# EAGLE design On Board Computer (EAGLE 9.6.2)

## Sheet 1 of 3
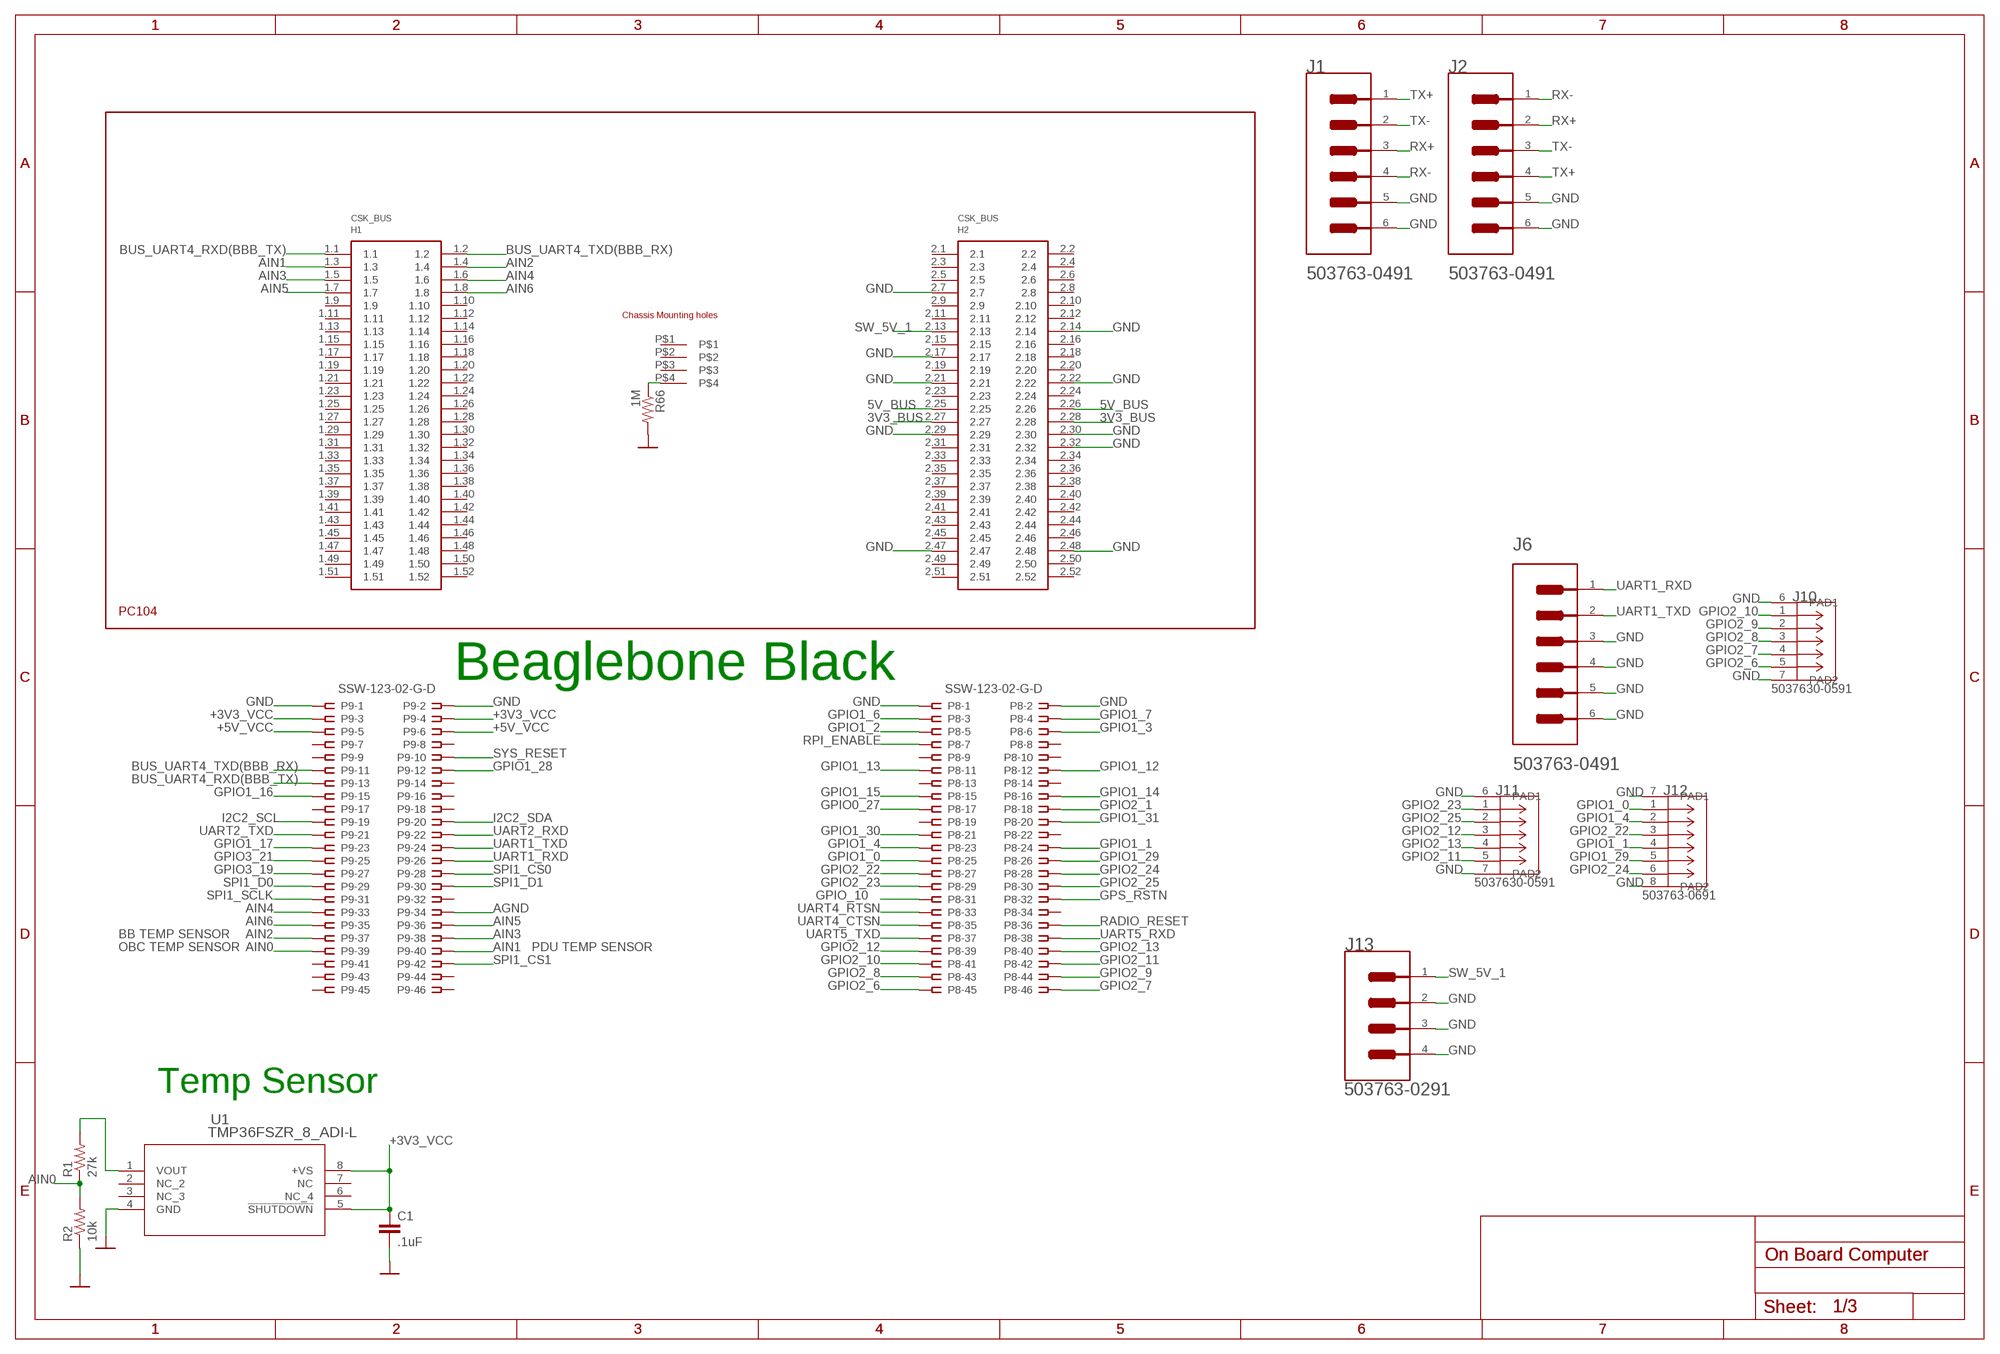
[diagram p0: schematic, sheet 1]

### Parts
C1  .1uF  CAP0805  [0805]
H1  PC104_WCONN  [PC104_WCONN]
J1  MOLEX_503763-0491MOLEX_503763-0491_0_0  [MOLEX_503763-0491_0]
J2  MOLEX_503763-0491MOLEX_503763-0491_0_0  [MOLEX_503763-0491_0]
J6  MOLEX_503763-0491MOLEX_503763-0491_0_0  [MOLEX_503763-0491_0]
J10  503763-0591  [CONN_5037630591_MOL]
J11  503763-0591  [CONN_5037630591_MOL]
J12  503763-0691  [CONN_503763-0691_MOL]
J13  MOLEX_503763-0291MOLEX_503763-0291_0_0  [MOLEX_503763-0291_0]
P8  SSW-123-02-G-D  [SSW-123-02-G-D]
P9  SSW-123-02-G-D  [SSW-123-02-G-D]
R1  27k  RESISTOR0805-RES  [0805]
R2  10k  RESISTOR0805-RES  [0805]
R66  1M  RESISTOR0805-RES  [0805]
U1  TMP36FSZR_8_ADI-L  [R_8_ADI-L]

### Nets
3V3_BUS: H1.2.27 H1.2.28 ; also sheet 3
5V_BUS: H1.2.25 H1.2.26
+3V3_VCC: C1.1 P9.3 P9.4 U1.5(!SHUTDOWN) U1.8(+VS) ; also sheet 3
+5V_VCC: P9.5 P9.6 ; also sheet 2
AGND: P9.34
AIN0: P9.39 R1.1 R2.2
AIN1: H1.1.3 P9.40
AIN2: H1.1.4 P9.37
AIN3: H1.1.5 P9.38
AIN4: H1.1.6 P9.33
AIN5: H1.1.7 P9.36
AIN6: H1.1.8 P9.35
BUS_UART4_RXD(BBB_TX): H1.1.1 P9.13
BUS_UART4_TXD(BBB_RX): H1.1.2 P9.11
GND: C1.2 H1.2.7 H1.2.14 H1.2.17 H1.2.21 H1.2.22 H1.2.29 H1.2.30 H1.2.32 H1.2.47 H1.2.48 J1.5(MNT_1) J1.6(MNT_2) J2.5(MNT_1) J2.6(MNT_2) J6.3 J6.4 J6.5(MNT_1) J6.6(MNT_2) J10.6(PAD1) J10.7(PAD2) J11.6(PAD1) J11.7(PAD2) J12.7(PAD1) J12.8(PAD2) J13.2 J13.3(MNT_1) J13.4(MNT_2) P8.1 P8.2 P9.1 P9.2 R2.1 R66.2 U1.4(GND) ; also sheet 2,3
GPIO0_27: P8.17
GPIO1_0: J12.1 P8.25
GPIO1_1: J12.4 P8.24
GPIO1_2: P8.5
GPIO1_3: P8.6
GPIO1_4: J12.2 P8.23
GPIO1_6: P8.3
GPIO1_7: P8.4
GPIO1_12: P8.12
GPIO1_13: P8.11
GPIO1_14: P8.16
GPIO1_15: P8.15
GPIO1_16: P9.15
GPIO1_17: P9.23
GPIO1_28: P9.12
GPIO1_29: J12.5 P8.26
GPIO1_30: P8.21
GPIO1_31: P8.20
GPIO2_1: P8.18
GPIO2_6: J10.5 P8.45
GPIO2_7: J10.4 P8.46
GPIO2_8: J10.3 P8.43
GPIO2_9: J10.2 P8.44
GPIO2_10: J10.1 P8.41
GPIO2_11: J11.5 P8.42
GPIO2_12: J11.3 P8.39
GPIO2_13: J11.4 P8.40
GPIO2_22: J12.3 P8.27
GPIO2_23: J11.1 P8.29
GPIO2_24: J12.6 P8.28
GPIO2_25: J11.2 P8.30
GPIO3_19: P9.27
GPIO3_21: P9.25
GPIO_10: P8.31
GPS_RSTN: P8.32 ; also sheet 3
I2C2_SCL: P9.19 ; also sheet 3
I2C2_SDA: P9.20 ; also sheet 3
N$15: R1.2 U1.1(VOUT)
N$94: H1.P$4 R66.1
RADIO_RESET: P8.36 ; also sheet 3
RPI_ENABLE: P8.7 ; also sheet 2
RX+: J1.3 J2.2
RX-: J1.4 J2.1
SPI1_CS0: P9.28
SPI1_CS1: P9.42 ; also sheet 3
SPI1_D0: P9.29 ; also sheet 3
SPI1_D1: P9.30 ; also sheet 3
SPI1_SCLK: P9.31 ; also sheet 3
SW_5V_1: H1.2.13 J13.1
SYS_RESET: P9.10
TX+: J1.1 J2.4
TX-: J1.2 J2.3
UART1_RXD: J6.1 P9.26
UART1_TXD: J6.2 P9.24
UART2_RXD: P9.22 ; also sheet 2
UART2_TXD: P9.21 ; also sheet 2
UART4_CTSN: P8.35
UART4_RTSN: P8.33
UART5_RXD: P8.38 ; also sheet 3
UART5_TXD: P8.37 ; also sheet 3
Unconnected: H1.1.9 H1.1.10 H1.1.11 H1.1.12 H1.1.13 H1.1.14 H1.1.15 H1.1.16 H1.1.17 H1.1.18 H1.1.19 H1.1.20 H1.1.21 H1.1.22 H1.1.23 H1.1.24 H1.1.25 H1.1.26 H1.1.27 H1.1.28 H1.1.29 H1.1.30 H1.1.31 H1.1.32 H1.1.33 H1.1.34 H1.1.35 H1.1.36 H1.1.37 H1.1.38 H1.1.39 H1.1.40 H1.1.41 H1.1.42 H1.1.43 H1.1.44 H1.1.45 H1.1.46 H1.1.47 H1.1.48 H1.1.49 H1.1.50 H1.1.51 H1.1.52 H1.2.1 H1.2.2 H1.2.3 H1.2.4 H1.2.5 H1.2.6 H1.2.8 H1.2.9 H1.2.10 H1.2.11 H1.2.12 H1.2.15 H1.2.16 H1.2.18 H1.2.19 H1.2.20 H1.2.23 H1.2.24 H1.2.31 H1.2.33 H1.2.34 H1.2.35 H1.2.36 H1.2.37 H1.2.38 H1.2.39 H1.2.40 H1.2.41 H1.2.42 H1.2.43 H1.2.44 H1.2.45 H1.2.46 H1.2.49 H1.2.50 H1.2.51 H1.2.52 H1.P$1 H1.P$2 H1.P$3 P8.8 P8.9 P8.10 P8.13 P8.14 P8.19 P8.22 P8.34 P9.7 P9.8 P9.9 P9.14 P9.16 P9.17 P9.18 P9.32 P9.41 P9.43 P9.44 P9.45 P9.46 U1.2(NC_2) U1.3(NC_3) U1.6(NC_4) U1.7(NC)

### Notes on the sheet
- Beaglebone Black
- BB TEMP SENSOR
- OBC TEMP SENSOR | PDU TEMP SENSOR
- Temp Sensor

## Sheet 2 of 3
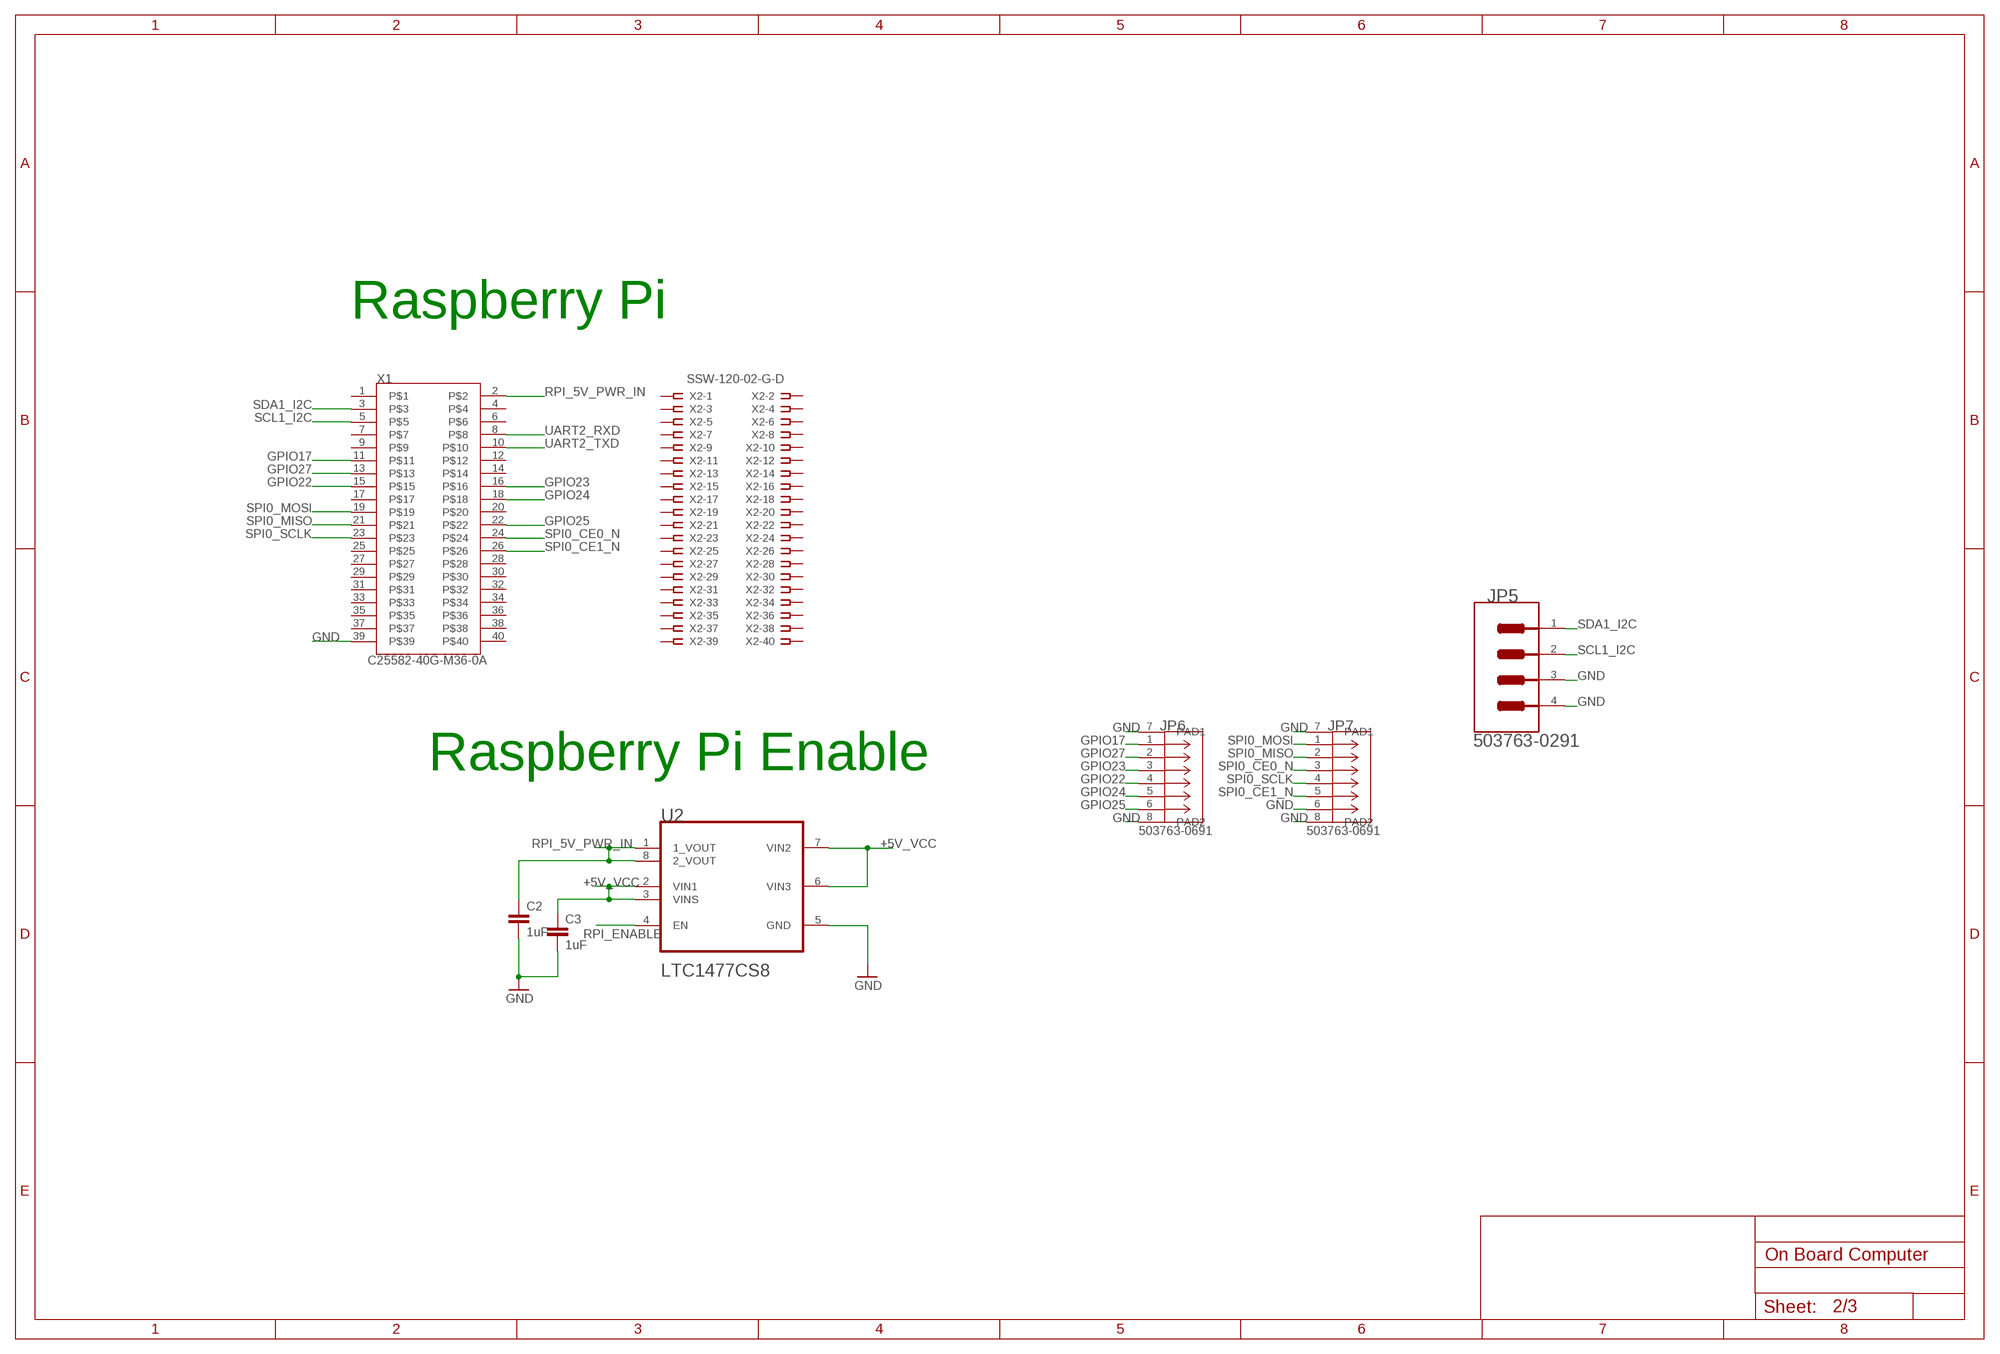
[diagram p1: schematic, sheet 2]

### Parts
C2  1uF  CAP0805  [0805]
C3  1uF  CAP0805  [0805]
JP5  MOLEX_503763-0291MOLEX_503763-0291_0_0  [MOLEX_503763-0291_0]
JP6  503763-0691  [CONN_503763-0691_MOL]
JP7  503763-0691  [CONN_503763-0691_MOL]
U2  LTC1477CS8LINEAR_TECHNOLOGY_LTC1477CS8_0_2  [LINEAR_TECHNOLOGY_LTC1477CS8_2]
X1  C25582-40G-M36-0A  [ADAFRUIT_C25582-40G-M36-0A_0]
X2  SSW-120-02-G-D  [SSW-120-02-G-D]

### Nets
+5V_VCC: C3.1 U2.2(VIN1) U2.3(VINS) U2.6(VIN3) U2.7(VIN2) ; also sheet 1
GND: C2.2 C3.2 JP5.3(MNT_1) JP5.4(MNT_2) JP6.7(PAD1) JP6.8(PAD2) JP7.6 JP7.7(PAD1) JP7.8(PAD2) U2.5(GND) X1.39 ; also sheet 1,3
GPIO17: JP6.1 X1.11
GPIO22: JP6.4 X1.15
GPIO23: JP6.3 X1.16
GPIO24: JP6.5 X1.18
GPIO25: JP6.6 X1.22
GPIO27: JP6.2 X1.13
RPI_5V_PWR_IN: C2.1 U2.1(1_VOUT) U2.8(2_VOUT) X1.2
RPI_ENABLE: U2.4(EN) ; also sheet 1
SCL1_I2C: JP5.2 X1.5
SDA1_I2C: JP5.1 X1.3
SPI0_CE0_N: JP7.3 X1.24
SPI0_CE1_N: JP7.5 X1.26
SPI0_MISO: JP7.2 X1.21
SPI0_MOSI: JP7.1 X1.19
SPI0_SCLK: JP7.4 X1.23
UART2_RXD: X1.8 ; also sheet 1
UART2_TXD: X1.10 ; also sheet 1
Unconnected: X1.1 X1.4 X1.6 X1.7 X1.9 X1.12 X1.14 X1.17 X1.20 X1.25 X1.27 X1.28 X1.29 X1.30 X1.31 X1.32 X1.33 X1.34 X1.35 X1.36 X1.37 X1.38 X1.40 X2.1 X2.2 X2.3 X2.4 X2.5 X2.6 X2.7 X2.8 X2.9 X2.10 X2.11 X2.12 X2.13 X2.14 X2.15 X2.16 X2.17 X2.18 X2.19 X2.20 X2.21 X2.22 X2.23 X2.24 X2.25 X2.26 X2.27 X2.28 X2.29 X2.30 X2.31 X2.32 X2.33 X2.34 X2.35 X2.36 X2.37 X2.38 X2.39 X2.40

### Notes on the sheet
- Raspberry Pi
- Raspberry Pi Enable

## Sheet 3 of 3
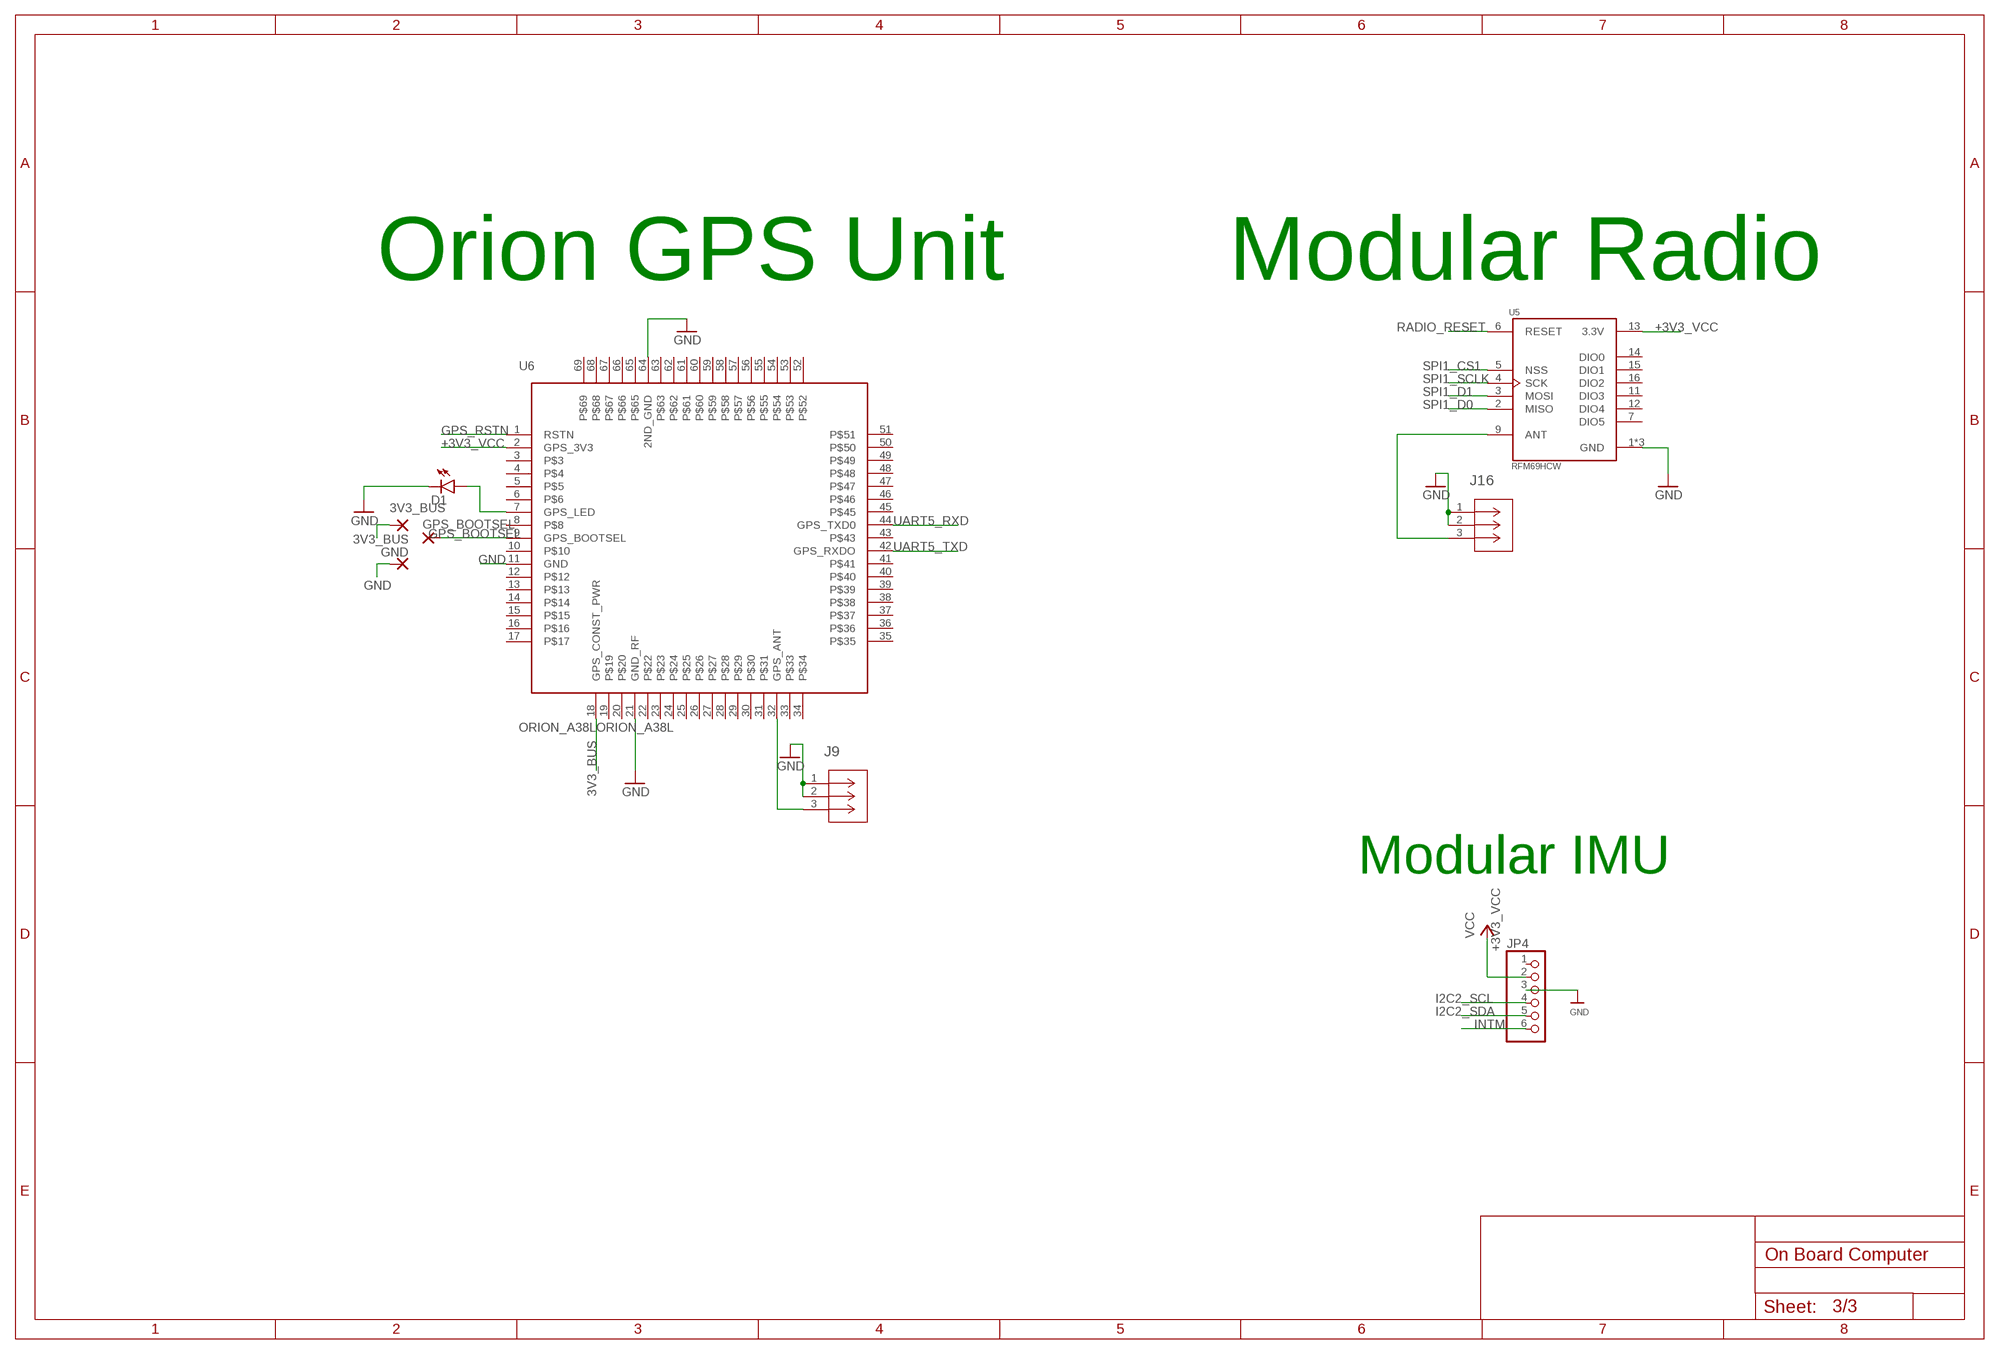
[diagram p2: schematic, sheet 3]

### Parts
3V3_BUS  1,6/0,9  [1,6/0,9]
D1  LEDCHIP-LED0603  [CHIP-LED0603]
GND  GND  1,6/0,9  [1,6/0,9]
GPS_BOOTSEL  1,6/0,9  [1,6/0,9]
J9  U.FL-R-SMT-1(01)  [CONN_-SMT-1(01)]
J16  U.FL-R-SMT-1(01)  [CONN_-SMT-1(01)]
JP4  HEADER-1X670MIL  [1X06_ROUND_70]
U5  RFM69HCW  [RFM69HCW]
U6  ORION_A38LORION_A38L  [ORION_A38L]

### Nets
3V3_BUS: 3V3_BUS.1(P) U6.18(GPS_CONST_PWR) ; also sheet 1
+3V3_VCC: JP4.2 U5.13(3.3V) U6.2(GPS_3V3) ; supply symbol labelled VCC ; also sheet 1
GND: D1.C GND.1(P) J9.1 J9.2 J16.1 J16.2 JP4.3 U5.1(GND) U5.8(GND) U5.10(GND) U6.11(GND) U6.21(GND_RF) U6.64(2ND_GND) ; also sheet 1,2
GPS_BOOTSEL: GPS_BOOTSEL.1(P) U6.9(GPS_BOOTSEL)
GPS_RSTN: U6.1(RSTN) ; also sheet 1
I2C2_SCL: JP4.4 ; also sheet 1
I2C2_SDA: JP4.5 ; also sheet 1
INTM: JP4.6
N$17: J9.3 U6.32(GPS_ANT)
N$19: J16.3 U5.9(ANT)
N$21: D1.A U6.7(GPS_LED)
RADIO_RESET: U5.6(RESET) ; also sheet 1
SPI1_CS1: U5.5(NSS) ; also sheet 1
SPI1_D0: U5.2(MISO) ; also sheet 1
SPI1_D1: U5.3(MOSI) ; also sheet 1
SPI1_SCLK: U5.4(SCK) ; also sheet 1
UART5_RXD: U6.44(GPS_TXD0) ; also sheet 1
UART5_TXD: U6.42(GPS_RXDO) ; also sheet 1
Unconnected: JP4.1 U5.7(DIO5) U5.11(DIO3) U5.12(DIO4) U5.14(DIO0) U5.15(DIO1) U5.16(DIO2) U6.3 U6.4 U6.5 U6.6 U6.8 U6.10 U6.12 U6.13 U6.14 U6.15 U6.16 U6.17 U6.19 U6.20 U6.22 U6.23 U6.24 U6.25 U6.26 U6.27 U6.28 U6.29 U6.30 U6.31 U6.33 U6.34 U6.35 U6.36 U6.37 U6.38 U6.39 U6.40 U6.41 U6.43 U6.45 U6.46 U6.47 U6.48 U6.49 U6.50 U6.51 U6.52 U6.53 U6.54 U6.55 U6.56 U6.57 U6.58 U6.59 U6.60 U6.61 U6.62 U6.63 U6.65 U6.66 U6.67 U6.68 U6.69

### Notes on the sheet
- Orion GPS Unit | Modular Radio
- Modular IMU

## Library data of the parts
3V3_BUS GND GPS_BOOTSEL = wirepad:1,6/0,9: THROUGH-HOLE PAD
C1-C3 = HSFL_Main_Library:CAP: Capacitor Standard 0603 ceramic capacitor, and 0.1" leaded capacitor.
D1 = led:LED: LED OSRAM: - CHIPLED LG R971, LG N971, LY N971, LG Q971, LY Q971, LO R971, LY R971 LH N974, LH R974 LS Q976, LO Q976, LY Q976 LO Q996 - Hyper CHIPLED LW Q18S LB Q993, LB Q99A, LB R99A - SideLED LS A670, LO A670, LY A670, LG A670, LP A670 LB A673, LV A673, LT A673, LW A673 LH A674 LY A675 LS A676, LA A676, LO A676, LY A676, LW A676 LS A679, LY A679, LG A679 - Hyper Micro SIDELED® LS Y876, LA Y876, LO Y876, LY Y876 LT Y87S - SmartLED LW L88C, LW L88S LB L89C, LB L89S, LG L890 LS L89K, LO L89K, LY L89K LS L896, LA L896, LO L896, LY L896 - TOPLED LS T670, LO T670, LY T670, LG T670, LP T670 LSG T670, LSP T670, LSY T670, LOP T670, LYG T670 LG T671, LOG T671, LSG T671 LB T673, LV T673, LT T673, LW T673 LH T674 LS T676, LA T676, LO T676, LY T676, LB T676, LH T676, LSB T676, LW T676 LB T67C, LV T67C, LT T67C, LS T67K, LO T67K, LY T67K, LW E67C LS E67B, LA E67B, LO E67B, LY E67B, LB E67C, LV E67C, LT E67C LW T67C LS T679, LY T679, LG T679 LS T770, LO T770, LY T770, LG T770, LP T770 LB T773, LV T773, LT T773, LW T773 LH T774 LS E675, LA E675, LY E675, LS T675 LS T776, LA T776, LO T776, LY T776, LB T776 LHGB T686 LT T68C, LB T68C - Hyper Mini TOPLED® LB M676 - Mini TOPLED Santana® LG M470 LS M47K, LO M47K, LY M47K Source: http://www.osram.convergy.de LUXEON: - LUMILED® LXK2-PW12-R00, LXK2-PW12-S00, LXK2-PW14-U00, LXK2-PW14-V00 LXK2-PM12-R00, LXK2-PM12-S00, LXK2-PM14-U00 LXK2-PE12-Q00, LXK2-PE12-R00, LXK2-PE12-S00, LXK2-PE14-T00, LXK2-PE14-U00 LXK2-PB12-K00, LXK2-PB12-L00, LXK2-PB12-M00, LXK2-PB14-N00, LXK2-PB14-P00, LXK2-PB14-Q00 LXK2-PR12-L00, LXK2-PR12-M00, LXK2-PR14-Q00, LXK2-PR14-R00 LXK2-PD12-Q00, LXK2-PD12-R00, LXK2-PD12-S00 LXK2-PH12-R00, LXK2-PH12-S00 LXK2-PL12-P00, LXK2-PL12-Q00, LXK2-PL12-R00 Source: www.luxeon.com KINGBRIGHT: KA-3528ASYC Source: www.kingbright.com
H1 = HSFL_Main_Library:PC104_WCONN
J1 J2 J6 = Molex - 503763-0491:MOLEX_503763-0491: Wire-To-Board Connector, Pico-Lock 503763 Series, Surface Mount, Header, 4 Contacts, 1 mm; AUTOMOTIVE: No; CENTROID_NOT_SPECIFIED: No; CONN_GENDER: Male; CONN_ORIENTATION: Right Angle; CONTACT_MATERIAL: Gold,Nickel; CURRENT_RATING: 1.5A; DATASHEET: https://www.molex.com/webdocs/datasheets/pdf/en-us/5037630491_PCB_HEADERS.pdf; DEVICE_CLASS_L1: Connectors; DEVICE_CLASS_L2: Headers and Wire Housings; DEVICE_CLASS_L3: unset; DIGIKEY_DESCRIPTION: CONN HEADER 1MM R/A 4CKT; DIGIKEY_PART_NUMBER: WM10655CT-ND; FOOTPRINT_URL: https://www.molex.com/pdm_docs/sd/5037630491_sd.pdf; FOOTPRINT_VARIANT_NAME_0: Recommended_Land_Pattern; HEIGHT: 1.7mm; LEAD_FREE: Yes; MF: Molex; MFG_PACKAGE_IDENT: 503763-0491; MFG_PACKAGE_IDENT_DATE: 0; MFG_PACKAGE_IDENT_REV: 0; MOUSER_PART_NUMBER: 538-503763-0491; MPN: 503763-0491; NUMBER_OF_CONTACTS: 4; NUMBER_OF_ROWS: 1; PACKAGE: HDR4; PITCH: 1mm; PREFIX: J; ROHS: Yes; TEMPERATURE_RANGE_HIGH: +105°C; TEMPERATURE_RANGE_LOW: -40°C; VERIFICATION_VERSION: 0.0.0.1; VOLTAGE_RATING: 150V
J9 J16 = U.FL-R-SMT:U.FL-R-SMT-1(01); BUILT_BY: EMA_Matt; COPYRIGHT: Copyright (C) 2018 Accelerated Designs. All rights reserved; MANUFACTURER_PART_NUMBER: U.FL-R-SMT-1(01); SOURCELIBRARY: Hirose_12_20_2019; VENDOR: Hirose
J10 J11 = Improved Molex 503763-0591:503763-0591; BUILT_BY: EMA_Cory; COPYRIGHT: Copyright (C) 2018 Accelerated Designs. All rights reserved; DATASHEET: https://www.molex.com/pdm_docs/sd/5037630591_sd.pdf; MANUFACTURER_PART_NUMBER: 503763-0591; SOURCELIBRARY: Add_to_database_2020-12-14; VENDOR: Molex Connector Corporation
J12 JP6 JP7 = Improved Molex 503763-0691:503763-0691; BUILT_BY: EMA_Cory; COPYRIGHT: Copyright (C) 2018 Accelerated Designs. All rights reserved; DATASHEET: https://www.digikey.com/products/en?keywords=503763-0691; MANUFACTURER_PART_NUMBER: 503763-0691; SOURCELIBRARY: Molex_2020-01-22; VENDOR: Molex Connector Corporation
J13 JP5 = Molex - 503763-0291:MOLEX_503763-0291: 2 Positions Header Connector 0.039" (1.00mm) Surface Mount, Right Angle Gold; CENTROID_NOT_SPECIFIED: No; DATASHEET: http://www.molex.com/pdm_docs/sd/5037630291_sd.pdf; DIGIKEY_DESCRIPTION: CONN HEADER 1MM R/A 2CKT; DIGIKEY_PART_NUMBER: WM10654CT-ND; LEAD_FREE: yes; MF: Molex; MOUSER_PART_NUMBER: 538-503763-0291; MPN: 503763-0291; PACKAGE: HDR02; PREFIX: J; ROHS: yes; TEMPERATURE_RANGE_HIGH: +105°C; TEMPERATURE_RANGE_LOW: -40°C
JP4 = microbuilder:HEADER-1X6: PIN HEADER
P8 P9 = con-samtec:SSW-123-02-G: THROUGH-HOLE .025" SQ POST SOCKET Source: Samtec SSW.pdf; MF: Samtec Inc.; MPN: SSW-123-02-G-D; OC_FARNELL: unknown; OC_NEWARK: 11P9690
R1 R2 R66 = HSFL_Main_Library:RESISTOR: Resistor Basic schematic elements and footprints for 0603, 1206, and PTH resistors.
U1 = TMP36FSZR_8:TMP36FSZ; COPYRIGHT: Copyright (C) 2021 Ultra Librarian. All rights reserved.; MANUFACTURER_PART_NUMBER: TMP36FSZ; MFR_NAME: Analog Devices Inc
U2 = Artemis:LTC1477CS8: LT-LTC1477-S8-8; CIIVA_IDS: 1432281; COMPONENT_LINK_1_DESCRIPTION: Manufacturer URL; COMPONENT_LINK_1_URL: http://www.linear.com/; COMPONENT_LINK_3_DESCRIPTION: Package Specification; COMPONENT_LINK_3_URL: http://cds.linear.com/docs/en/packaging/05081610_G_SO8.pdf; DATASHEET: http://cds.linear.com/docs/en/datasheet/lt1477.pdf; FOOTPRINT_VARIANT_NAME_0: Level C; FOOTPRINT_VARIANT_NAME_1: Level B; FOOTPRINT_VARIANT_NAME_2: Level A; IMPORTED: yes; IMPORTED_FROM: vault; IMPORT_TS: 1521843574; MF: Linear Technology; MOUNTING_TECHNOLOGY: Surface Mount; MPN: LTC1477CS8; PACKAGE: S8-8; PACKAGE_DESCRIPTION: 8-Pin Plastic Small Outline (Narrow .150 Inch), Body 4.9 x 3.9 mm, Pitch 1.27 mm; PACKAGE_VERSION: Rev. G, 03/2012; PREFIX: U; RELEASE_DATE: 1377817843; ROHS: No; VAULT_GUID: 635B2D7C-EC07-409E-A57F-666E02CD64AC; VAULT_REVISION: 6B8B57C2-2CB3-4970-A31A-1EB58B636423
U5 = Artemis:RFM69HCW: Rfm69hcw Wireless Transceiver 91 Check prices <https://pricing.snapeda.com/parts/RFM69HCW-315S2/HOPERF/view-part?ref=eda>; AVAILABILITY: No availability data; DESCRIPTION: General ISM < 1GHz Transceiver Module 915MHz Surface Mount; MF: HOPERF; MP: RFM69HCW-315S2; PACKAGE: Module SparkFun Electronics; PRICE: None
U6 = Artemis:ORION_A38L
X1 = Adafruit - C25582-40G-M36-0A:C25582-40G-M36-0A
X2 = con-samtec:SSW-120-02-G: THROUGH-HOLE .025" SQ POST SOCKET Source: Samtec SSW.pdf; MF: Samtec Inc.; MPN: SSW-120-02-G-D; OC_FARNELL: unknown; OC_NEWARK: 11P9639

## Net classes
2 lowpower: width 0.305 mm, drill 0.483 mm

## Board
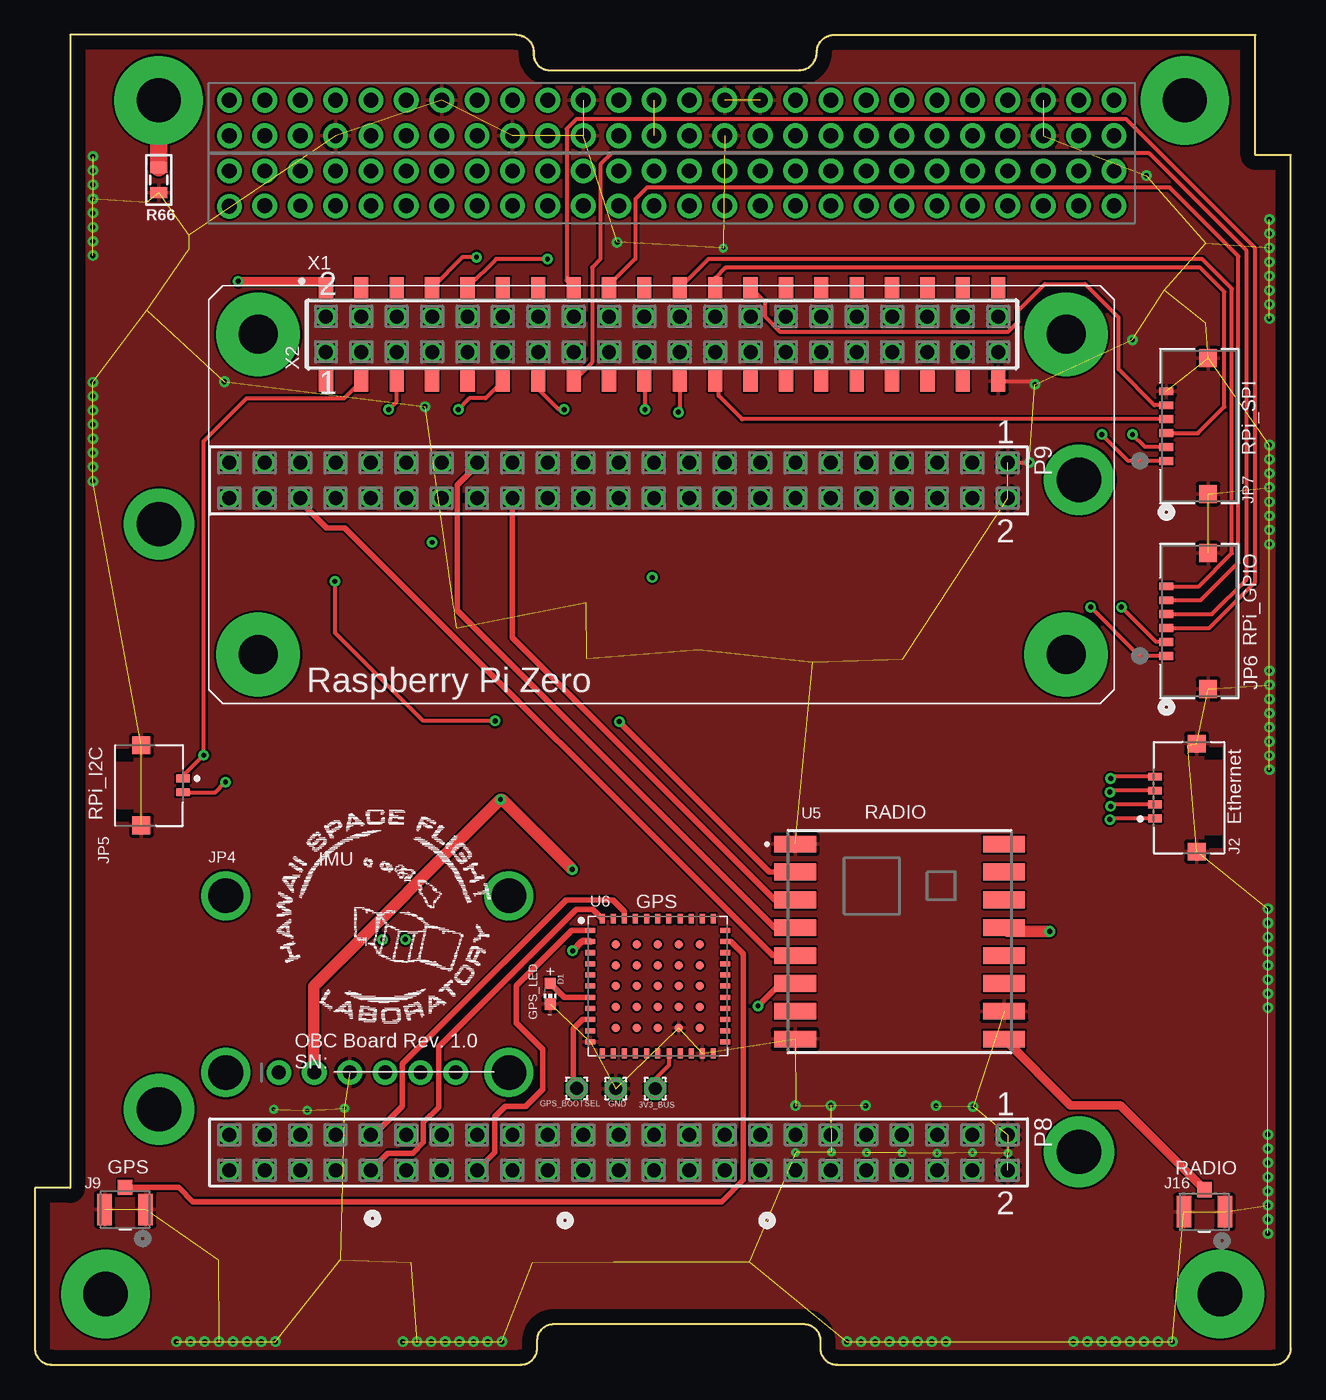
[diagram p3: board, top side]
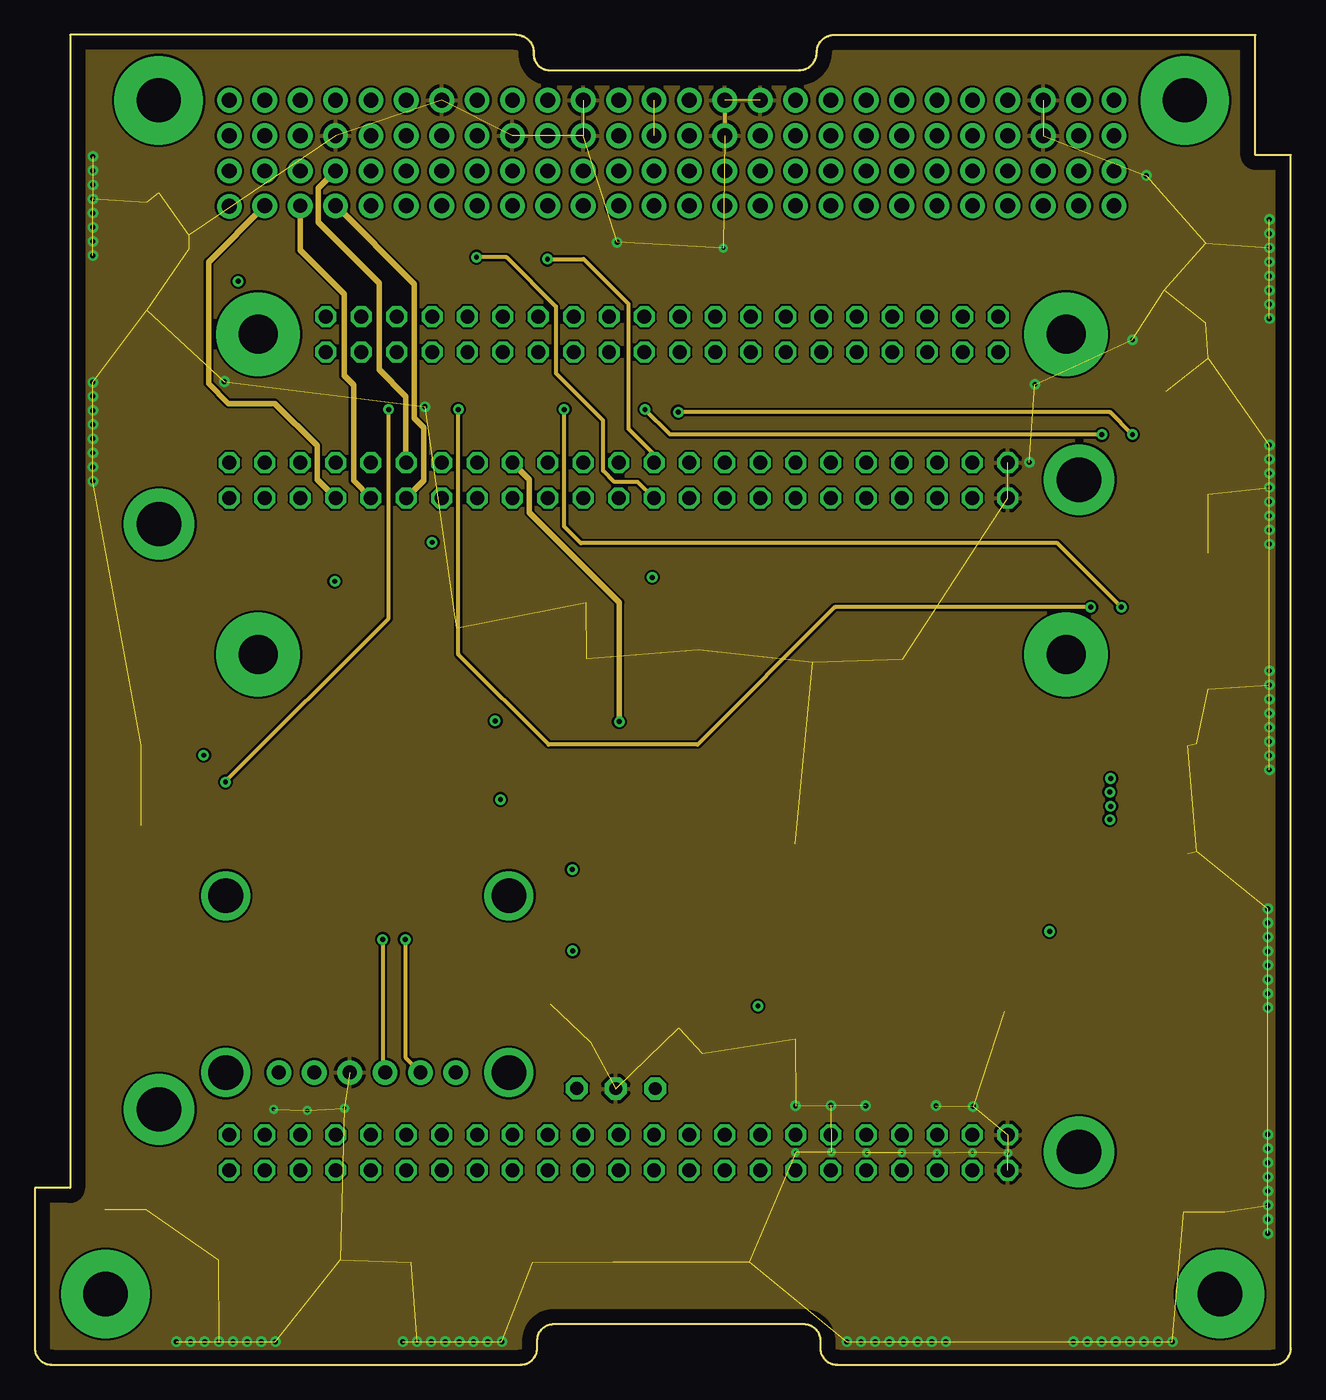
[diagram p4: board, inner layer Route2]
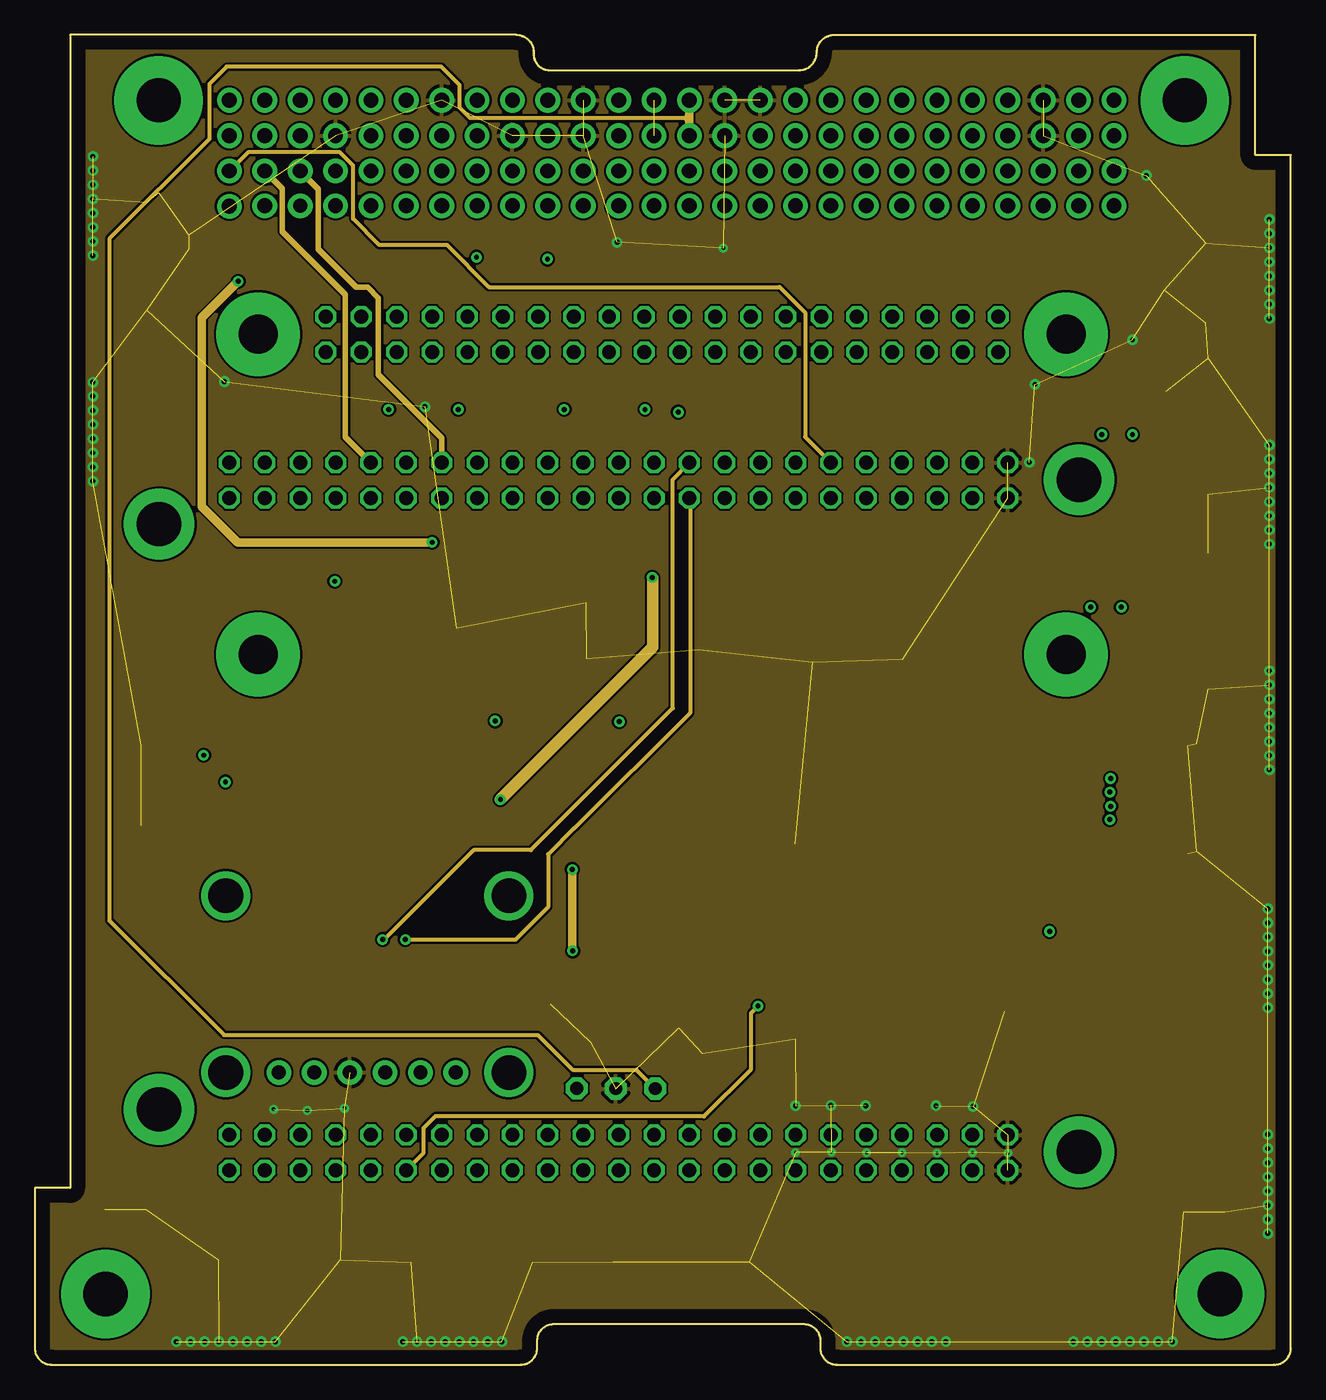
[diagram p5: board, inner layer Route15]
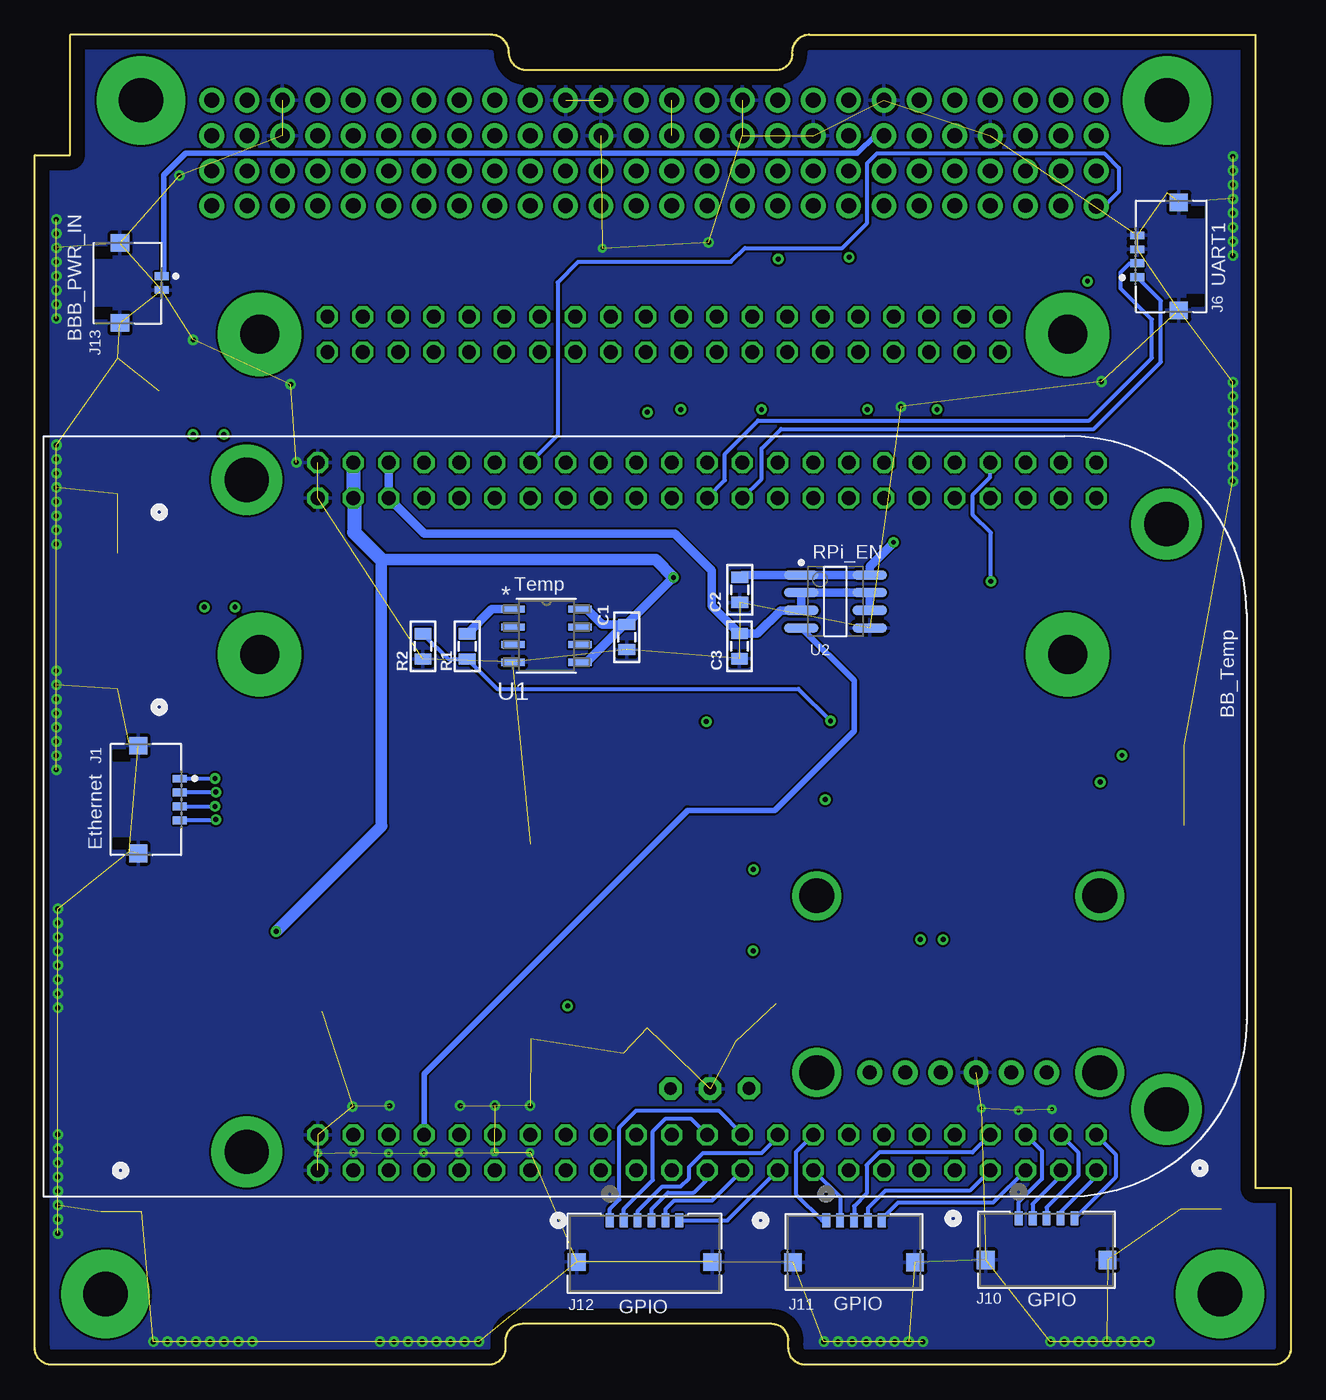
[diagram p6: board, bottom side, seen from below]

Size 90.17 x 95.5 mm. Coordinates in mm from the lower left corner, seen from the top.
Copper layers (1+2*15+16): Top 0.035mm / dielectric 1.5mm / Route2 0.035mm / dielectric 0.15mm / Route15 0.035mm / dielectric 0.2mm / Bottom 0.035mm
Design rules "default *": minimum track width 6mil, minimum drill 8mil, track to track 6mil, track to pad 6mil, pad to pad 6mil, via to via 6mil, smd to smd 6mil, copper to edge 40mil, drill to drill 6mil, minimum pad ring 10mil, minimum via ring 8mil, stop-mask expansion 4mil, vias tented up to drill 0mil, thermal gap 10mil

### Footprints (pad centres in the part's own frame; a part is rotated, then mirrored left to right if it is on the bottom)
1,6/0,9 = drill 0.914 pad 1.6 octagon: 1 0,0
0805 = smd 0.8 x 1.2: 1 -0.9,0; 2 0.9,0
CHIP-LED0603 = smd 0.8 x 0.8: A 0,-0.75; C 0,0.75
PC104_WCONN = drill 1.067 pad 1.778: 1.1 13.97,83.185; 1.2 13.97,85.725; 1.3 16.51,83.223; 1.4 16.51,85.725; 1.6 19.05,85.725; 1.7 21.59,83.223; 1.8 21.59,85.725; 1.9 24.13,83.223; 1.10 24.13,85.725; 1.11 26.67,83.223; 1.12 26.67,85.725; 1.13 29.21,83.223; 1.14 29.21,85.725; 1.15 31.75,83.223; 1.16 31.75,85.725; 1.17 34.29,83.223; 1.18 34.29,85.725; 1.19 36.83,83.223; 1.20 36.83,85.725; 1.21 39.37,83.223; 1.22 39.37,85.725; 1.23 41.91,83.223; 1.24 41.91,85.725; 1.25 44.45,83.223; 1.26 44.45,85.725; 1.27 46.99,83.223; 1.28 46.99,85.725; 1.29 49.53,83.223; 1.30 49.53,85.725; 1.31 52.07,83.223; 1.32 52.07,85.725; 1.33 54.61,83.223; 1.34 54.61,85.725; 1.35 57.15,83.223; 1.36 57.15,85.725; 1.37 59.69,83.223; 1.38 59.69,85.725; 1.39 62.23,83.223; 1.40 62.23,85.725; 1.41 64.77,83.223; 1.42 64.77,85.725; 1.43 67.31,83.223; 1.44 67.31,85.725; 1.45 69.85,83.223; 1.46 69.85,85.725; 1.47 72.39,83.223; 1.48 72.39,85.725; 1.49 74.93,83.223; 1.50 74.93,85.725; 1.51 77.47,83.223; 1.52 77.47,85.725; 2.1 13.97,88.265; 2.2 13.97,90.805; 2.3 16.51,88.265; 2.4 16.51,90.805; 2.5 19.05,88.265; 2.6 19.05,90.805; 2.7 21.59,88.265; 2.8 21.59,90.805; 2.9 24.13,88.265; 2.10 24.13,90.805; 2.11 26.67,88.265; 2.12 26.67,90.805; 2.13 29.21,88.265; 2.14 29.21,90.805; 2.15 31.75,88.265; 2.16 31.75,90.805; 2.17 34.29,88.265; 2.18 34.29,90.805; 2.19 36.83,88.265; 2.20 36.83,90.805; 2.21 39.37,88.265; 2.22 39.37,90.805; 2.23 41.91,88.265; 2.24 41.91,90.805; 2.25 44.45,88.265; 2.26 44.45,90.805; 2.27 46.99,88.265; 2.28 46.99,90.805; 2.29 49.53,88.265; 2.30 49.53,90.805; 2.31 52.07,88.265; 2.32 52.07,90.805; 2.33 54.61,88.265; 2.34 54.61,90.805; 2.35 57.15,88.265; 2.36 57.15,90.805; 2.37 59.69,88.265; 2.38 59.69,90.805; 2.39 62.23,88.265; 2.40 62.23,90.805; 2.41 64.77,88.265; 2.42 64.77,90.805; 2.43 67.31,88.265; 2.44 67.31,90.805; 2.45 69.85,88.265; 2.46 69.85,90.805; 2.47 72.39,88.265; 2.48 72.39,90.805; 2.49 74.93,88.265; 2.50 74.93,90.805; 2.51 77.47,88.265; 2.52 77.47,90.805 | drill 1.016 pad 1.778: 1.5 19.05,83.223 | drill 3.175 pad 6.35: P$1 5.08,5.08; P$2 85.09,5.08; P$3 82.55,90.805; P$4 8.89,90.805
MOLEX_503763-0491_0 = smd 0.55 x 1: 1 1.5,-2.435; 2 0.5,-2.435; 3 -0.5,-2.435; 4 -1.5,-2.435 | smd 1.26 x 1.3: 5 -3.875,0.555; 6 3.875,0.555
CONN_-SMT-1(01) = smd 1.041 x 2.261: 1 -1.47,0; 2 1.47,0 | smd 1.041 x 1.092: 3 0,-1.596
CONN_5037630591_MOL = smd 0.559 x 0.991: 1 -2,2.261; 2 -1,2.261; 3 0,2.261; 4 1,2.261; 5 2,2.261 | smd 1.27 x 1.295: 6 -4.375,-0.729; 7 4.375,-0.729
CONN_503763-0691_MOL = smd 0.559 x 0.991: 1 2.5,-2.368; 2 1.5,-2.368; 3 0.5,-2.368; 4 -0.5,-2.368; 5 -1.5,-2.368; 6 -2.5,-2.368 | smd 1.295 x 1.27: 7 -4.875,0.622; 8 4.875,0.622
MOLEX_503763-0291_0 = smd 0.55 x 1: 1 0.5,-2.435; 2 -0.5,-2.435 | smd 1.26 x 1.3: 3 -2.875,0.555; 4 2.875,0.555
1X06_ROUND_70 = drill 1 pad 1.778: 1 -6.35,0; 2 -3.81,0; 3 -1.27,0; 4 1.27,0; 5 3.81,0; 6 6.35,0
SSW-123-02-G-D = drill 1 pad 1.5 octagon: 1 -27.94,-1.27; 2 -27.94,1.27; 3 -25.4,-1.27; 4 -25.4,1.27; 5 -22.86,-1.27; 6 -22.86,1.27; 7 -20.32,-1.27; 8 -20.32,1.27; 9 -17.78,-1.27; 10 -17.78,1.27; 11 -15.24,-1.27; 12 -15.24,1.27; 13 -12.7,-1.27; 14 -12.7,1.27; 15 -10.16,-1.27; 16 -10.16,1.27; 17 -7.62,-1.27; 18 -7.62,1.27; 19 -5.08,-1.27; 20 -5.08,1.27; 21 -2.54,-1.27; 22 -2.54,1.27; 23 0,-1.27; 24 0,1.27; 25 2.54,-1.27; 26 2.54,1.27; 27 5.08,-1.27; 28 5.08,1.27; 29 7.62,-1.27; 30 7.62,1.27; 31 10.16,-1.27; 32 10.16,1.27; 33 12.7,-1.27; 34 12.7,1.27; 35 15.24,-1.27; 36 15.24,1.27; 37 17.78,-1.27; 38 17.78,1.27; 39 20.32,-1.27; 40 20.32,1.27; 41 22.86,-1.27; 42 22.86,1.27; 43 25.4,-1.27; 44 25.4,1.27; 45 27.94,-1.27; 46 27.94,1.27
R_8_ADI-L = smd 1.676 x 0.508: 1 -2.413,1.905; 2 -2.413,0.635; 3 -2.413,-0.635; 4 -2.413,-1.905; 5 2.413,-1.905; 6 2.413,-0.635; 7 2.413,0.635; 8 2.413,1.905
LINEAR_TECHNOLOGY_LTC1477CS8_2 = smd 2.5 x 0.7: 1 -2.45,1.905; 2 -2.45,0.635; 3 -2.45,-0.635; 4 -2.45,-1.905; 5 2.45,-1.905; 6 2.45,-0.635; 7 2.45,0.635; 8 2.45,1.905
RFM69HCW = smd 3 x 1.2: 1 -7.5,7; 2 -7.5,5; 3 -7.5,3; 4 -7.5,1; 5 -7.5,-1; 6 -7.5,-3; 7 -7.5,-5; 8 -7.5,-7; 9 7.5,-7; 10 7.5,-5; 11 7.5,-3; 12 7.5,-1; 13 7.5,1; 14 7.5,3; 15 7.5,5; 16 7.5,7
ORION_A38L = smd 0.7 x 0.36: 1 -4.84,4; 2 -4.84,3.2; 3 -4.84,2.4; 4 -4.84,1.6; 5 -4.84,0.8; 6 -4.84,0; 7 -4.84,-0.8; 8 -4.84,-1.6; 9 -4.84,-2.4; 10 -4.84,-3.2; 11 -4.84,-4; 23 4.84,-4; 24 4.84,-3.2; 25 4.84,-2.4; 26 4.84,-1.6; 27 4.84,-0.8; 28 4.84,0; 29 4.84,0.8; 30 4.84,1.6; 31 4.84,2.4; 32 4.84,3.2; 33 4.84,4 | smd 0.36 x 0.7: 12 -4,-4.84; 13 -3.2,-4.84; 14 -2.4,-4.84; 15 -1.6,-4.84; 16 -0.8,-4.84; 17 0,-4.84; 18 0.81,-4.84; 19 1.6,-4.84; 20 2.4,-4.84; 21 3.2,-4.84; 22 4,-4.84; 34 4,4.84; 35 3.2,4.84; 36 2.4,4.84; 37 1.6,4.84; 38 0.8,4.84; 39 0,4.84; 40 -0.8,4.84; 41 -1.6,4.84; 42 -2.4,4.84; 43 -3.18,4.84; 44 -4,4.84 | smd 0.6 x 0.6: 45 -3,3; 46 -3,1.5; 47 -3,0; 48 -3,-1.5; 49 -3,-3; 50 -1.5,3; 51 -1.5,1.5; 52 -1.5,0; 53 -1.5,-1.5; 54 -1.5,-3; 55 0,3; 56 0,1.5; 57 0,0; 58 0,-1.5; 59 0,-3; 60 1.5,3; 61 1.5,1.5; 62 1.5,0; 63 1.5,-1.5; 64 1.5,-3; 65 3,3; 66 3,1.5; 67 3,0; 68 3,-1.5; 69 3,-3
ADAFRUIT_C25582-40G-M36-0A_0 = smd 1.02 x 1.524: 1 -24.13,-3.354; 2 -24.13,3.354; 3 -21.59,-3.354; 4 -21.59,3.354; 5 -19.05,-3.354; 6 -19.05,3.354; 7 -16.51,-3.354; 8 -16.51,3.354; 9 -13.97,-3.354; 10 -13.97,3.354; 11 -11.43,-3.354; 12 -11.43,3.354; 13 -8.89,-3.354; 14 -8.89,3.354; 15 -6.35,-3.354; 16 -6.35,3.354; 17 -3.81,-3.354; 18 -3.81,3.354; 19 -1.27,-3.354; 20 -1.27,3.354; 21 1.27,-3.354; 22 1.27,3.354; 23 3.81,-3.354; 24 3.81,3.354; 25 6.35,-3.354; 26 6.35,3.354; 27 8.89,-3.354; 28 8.89,3.354; 29 11.43,-3.354; 30 11.43,3.354; 31 13.97,-3.354; 32 13.97,3.354; 33 16.51,-3.354; 34 16.51,3.354; 35 19.05,-3.354; 36 19.05,3.354; 37 21.59,-3.354; 38 21.59,3.354; 39 24.13,-3.354; 40 24.13,3.354
SSW-120-02-G-D = drill 1 pad 1.5 octagon: 1 -24.13,-1.27; 2 -24.13,1.27; 3 -21.59,-1.27; 4 -21.59,1.27; 5 -19.05,-1.27; 6 -19.05,1.27; 7 -16.51,-1.27; 8 -16.51,1.27; 9 -13.97,-1.27; 10 -13.97,1.27; 11 -11.43,-1.27; 12 -11.43,1.27; 13 -8.89,-1.27; 14 -8.89,1.27; 15 -6.35,-1.27; 16 -6.35,1.27; 17 -3.81,-1.27; 18 -3.81,1.27; 19 -1.27,-1.27; 20 -1.27,1.27; 21 1.27,-1.27; 22 1.27,1.27; 23 3.81,-1.27; 24 3.81,1.27; 25 6.35,-1.27; 26 6.35,1.27; 27 8.89,-1.27; 28 8.89,1.27; 29 11.43,-1.27; 30 11.43,1.27; 31 13.97,-1.27; 32 13.97,1.27; 33 16.51,-1.27; 34 16.51,1.27; 35 19.05,-1.27; 36 19.05,1.27; 37 21.59,-1.27; 38 21.59,1.27; 39 24.13,-1.27; 40 24.13,1.27

### Placement (x,y rotation side)
3V3_BUS  44.54,19.82 0 top
C1  47.68,52.25 270 bottom
C2  39.56,55.65 270 bottom
C3  39.59,51.6 270 bottom
D1  37,26.64 180 top
GND  41.7,19.82 0 top
GPS_BOOTSEL  38.9,19.84 0 top
H1  0,0 0 top
J1  82.19,40.59 90 bottom
J2  82.85,40.73 270 top
J6  8.6,79.6 270 bottom
J9  6.48,11.14 180 top
J10  17.54,8.24 0 bottom
J11  31.36,8.1 0 bottom
J12  46.4,8 180 bottom
J13  83.5,77.68 90 bottom
J16  83.96,10.98 180 top
JP4  23.88,20.98 0 top
JP5  8.2,41.6 90 top
JP6  83.6,53.4 270 top
JP7  83.6,67.4 270 top
P8  41.91,15.24 180 top
P9  41.91,63.5 180 top
R1  59.13,51.59 90 bottom
R2  62.31,51.59 90 bottom
R66  8.89,85.07 270 top
U1  53.44,52.35 0 bottom
U2  32.7,54.81 0 bottom
U5  62.08,30.38 0 top
U6  44.72,27.19 0 top
X1  45.03,74 0 top
X2  45.03,74 0 top

### Tracks (layer width: path | path; a pad name or v marks a point on that pad's centre or on a via)
3V3_BUS
  Top 0.305: 3V3_BUS.1 44.54,20.54 45.53,21.53 U6.18
  Route15 0.305: 46.88,89.52 31.25,89.52 30.49,90.28 30.49,91.89 29.16,93.22 13.77,93.22 12.52,91.97 12.52,88.01 5.36,80.85 5.36,31.9 13.59,23.67 36.12,23.67 38.61,21.18 43.18,21.18 3V3_BUS.1
  Route15 0.61: H1.2.28 46.99,89.64 | 46.99,89.64 H1.2.27 | 46.99,89.64 46.88,89.52
5V_BUS  (1 unrouted)
+3V3_VCC  (via drill 0.35)
  Top 0.508: U6.2 39.28,30.39 v38.61,29.72
  Top 0.61: 69.84,31.11 U5.13 | 33.55,40.59 v33.43,40.59
  Top 0.813: v72.85,31.11 69.84,31.11 | v38.58,35.56 33.55,40.59 | v33.43,40.59 20.02,27.18 20.02,21.03 JP4.2
  Route15 0.508: 44.37,56.49 v44.32,56.54
  Route15 0.61: v38.58,35.56 38.58,29.74 v38.61,29.72
  Route15 0.813: 44.37,56.49 44.37,51.54 v33.43,40.59
  Bottom 0.305: P9.4 67.24,62.16
  Bottom 0.61: 65.25,38.68 65.29,38.72 | v72.85,31.11 72.82,31.11 | C1.1 47.68,53.19 v44.32,56.54 | C1.1 49.45,53.15 50.56,54.25 U1.8 | C1.1 47.86,53.15 50.56,50.44 U1.5
  Bottom 0.813: 65.29,38.72 65.29,57.81 45.59,57.81 v44.32,56.54 | 72.82,31.11 65.25,38.68
  Bottom 1.016: 67.24,62.16 67.24,59.76 65.29,57.81 | P9.3 P9.4
+5V_VCC
  Bottom 0.61: P9.5 P9.6 62.23,59.69 44.25,59.69 41.58,57.02 41.58,54.49 C3.1 38.31,52.5 36.63,54.18 U2.3 U2.2 U2.7 U2.6
AIN0  (via drill 0.35)
  Top 0.305: v33.05,46.23 27.89,46.23 21.54,52.58 v21.54,56.26
  Bottom 0.305: R2.2 60.51,50.69 R1.1 56.98,48.54 35.36,48.54 v33.05,46.23 | v21.54,56.26 21.54,59.74 22.83,61.03 22.83,62.49 21.59,63.73 P9.39
AIN1
  Route2 0.406: P9.40 20.27,63.55 20.27,65.99 17.22,69.04 13.9,69.04 12.47,70.46 12.47,79.18 H1.1.3
AIN2
  Route15 0.406: H1.1.4 17.78,84.45 17.78,81.38 22.3,76.86 22.3,66.6 P9.37
AIN3
  Route2 0.406: P9.38 22.89,63.48 22.89,70.33 22.2,71.02 22.2,76.89 19.05,80.03 H1.1.5
AIN4
  Route15 0.406: H1.1.6 20.34,84.43 20.34,80.11 23.09,77.37 23.9,77.37 24.66,76.61 24.66,71.09 29.21,66.55 P9.33
AIN5
  Route2 0.406: H1.1.7 21.63,83.22 27.24,77.61 27.24,67.99 27.91,67.31 27.91,63.48 P9.36
AIN6
  Route2 0.406: P9.35 26.64,64.8 26.64,69.52 24.71,71.45 24.71,77.67 20.34,82.04 20.34,84.51 21.57,85.72 H1.1.8
BUS_UART4_RXD(BBB_TX)
  Bottom 0.305: H1.1.1 13.41,83.19 12.35,84.25 12.35,85.94 13.41,87 29.7,87 30.42,86.27 30.42,81.98 32.2,80.2 39.2,80.2 40.2,79.2 51.14,79.2 52.63,77.71 52.63,66.75 P9.13
BUS_UART4_TXD(BBB_RX)
  Route15 0.305: H1.1.2 15.31,87.07 21.89,87.07 22.85,86.11 22.85,82.29 24.74,80.4 29.6,80.4 32.6,77.4 53.46,77.4 55.3,75.56 55.3,66.62 P9.11
GND  (via drill 0.2 pad 0.41, 0.25, 0.35)  (166 unrouted)
  Top 0.305: X1.39 71.56,70.64 v71.8,70.4 | P9.1 69.88,64.8 v71.4,64.8
  Route2 0.305: H1.2.30 H1.2.29
  other vias: 54.61,18.59 57.15,18.62 59.64,18.59 64.69,18.59 67.36,18.54 10.16,1.65 12.19,1.65 13.21,1.65 14.22,1.65 15.24,1.65 16.26,1.65 17.27,1.65 11.18,1.65 26.42,1.65 27.43,1.65 28.45,1.65 29.46,1.65 30.48,1.65 31.5,1.65 32.51,1.65 33.53,1.65 4.17,79.65 4.17,81.69 4.17,82.7 4.17,83.72 4.17,84.73 4.17,85.75 4.17,86.77 4.17,80.67 4.17,63.45 4.17,65.48 4.17,66.5 4.17,67.51 4.17,68.53 4.17,69.55 4.17,70.56 4.17,64.47 58.29,1.65 60.33,1.65 61.34,1.65 62.36,1.65 63.37,1.65 64.39,1.65 65.41,1.65 59.31,1.65 74.55,1.65 75.56,1.65 76.58,1.65 77.6,1.65 78.61,1.65 79.63,1.65 80.64,1.65 81.66,1.65 22.23,18.41 19.56,18.26 17.14,18.34 54.61,15.24 49.43,80.19 88.52,25.63 88.52,27.66 88.52,28.68 88.52,29.69 88.52,30.71 88.52,31.72 88.52,32.74 88.52,26.64 88.52,9.42 88.52,11.46 88.52,12.47 88.52,13.49 88.52,14.5 88.52,15.52 88.52,16.54 88.52,10.44 88.62,58.93 88.62,60.96 88.62,61.98 88.62,62.99 88.62,64.01 88.62,65.02 88.62,66.04 88.62,59.94 88.62,42.72 88.62,44.75 88.62,45.77 88.62,46.79 88.62,47.8 88.62,48.82 88.62,49.83 88.62,43.74 88.62,75.13 88.62,77.17 88.62,78.18 88.62,79.2 88.62,80.21 88.62,81.23 88.62,82.25 88.62,76.15 57.18,15.27 59.72,15.21 62.26,15.21 64.77,15.19 67.31,15.24 69.85,15.19 13.6,70.6 28,68.8 78.8,73.6 41.8,80.6 79.8,85.4
  pour Top: 92.52,-5.29 92.52,98.21 -4.78,98.21 -4.78,-5.29
  pour Bottom: -5.78,98.91 -5.78,-6.19 93.22,-6.19 93.22,98.91
  pour Route2: 93.4,98.2 0.6,98.2 -3,98.2 -3,-5.8 93.4,-5.8
  pour Route15: 91.4,97 -3.8,97 -3.8,-3.2 91.4,-3.2
GPIO1_0
  Bottom 0.305: J12.1 48.88,10.38 48.88,11.19 48.2,11.87 48.2,17.04 47,18.25 41.09,18.25 39.37,16.53 P8.25
GPIO1_1
  Bottom 0.305: J12.4 45.88,10.38 45.88,11.19 44.73,12.34 42.88,12.34 41.91,13.31 P8.24
GPIO1_4
  Bottom 0.305: J12.2 47.88,10.38 47.88,11.19 45.8,13.27 45.8,16.77 44.88,17.69 43.09,17.69 P8.23
GPIO1_29
  Bottom 0.305: J12.5 44.88,10.38 44.88,11.19 44.27,11.8 41.54,11.8 P8.26
GPIO2_6
  Bottom 0.305: P8.45 12.57,15.11 12.57,13.46 J10.5
GPIO2_7
  Bottom 0.305: P8.46 13.97,13.54 16.54,10.97 J10.4
GPIO2_8
  Bottom 0.305: P8.43 15.27,15.27 15.27,13.56 17.54,11.29 J10.3
GPIO2_9
  Bottom 0.305: P8.44 16.51,13.56 18.54,11.54 J10.2
GPIO2_10
  Bottom 0.305: P8.41 17.88,15.34 17.88,13.34 19.56,11.66 19.56,10.53 J10.1
GPIO2_11
  Bottom 0.305: P8.42 21.39,11.63 28.22,11.63 29.36,10.49 J11.5
GPIO2_12
  Bottom 0.305: P8.39 22.86,15.24 29.57,15.24 30.45,14.35 30.45,12.29 31.36,11.39 J11.3
GPIO2_13
  Bottom 0.305: P8.40 23.06,12.5 29.11,12.5 30.36,11.24 J11.4
GPIO2_22
  Bottom 0.305: J12.3 46.88,10.38 46.88,11.04 45.12,12.8 43.8,12.8 43.2,13.4 43.2,14.2 42.2,15.2 38,15.2 36.83,16.37 P8.27
GPIO2_23
  Bottom 0.305: P8.29 35.53,15.27 35.53,12.24 33.65,10.36 J11.1
GPIO2_24
  Bottom 0.305: J12.6 40.44,10.37 36.84,13.97 P8.28
GPIO2_25
  Bottom 0.305: P8.30 32.36,12.04 J11.2
GPIO17  (via drill 0.35)
  Top 0.305: JP6.1 79.3,50.9 v75.8,54.4 | v30.4,68.6 31.2,69.4 32.36,69.4 X1.11
  Route2 0.305: v75.8,54.4 57.43,54.4 47.57,44.54 36.88,44.54 30.4,51.02 v30.4,68.6
GPIO22
  Top 0.305: JP6.4 84.5,53.9 87,56.4 87,80 80,87 41.4,87 40.6,86.2 40.6,79.4 40,78.8 40,71.96 X1.15
GPIO23
  Top 0.305: JP6.3 84.3,52.9 87.6,56.2 87.6,80.2 78.34,89.46 38.88,89.46 38.18,88.76 38.18,77.86 X1.16
GPIO24
  Top 0.305: JP6.5 83.7,54.9 86.4,57.6 86.4,79.6 81.47,84.53 43.93,84.53 43.1,83.7 43.1,79.43 41.22,77.54 X1.18
GPIO25
  Top 0.305: JP6.6 83.56,55.9 85.94,58.28 85.94,77.26 83.8,79.4 48.35,79.4 X1.22
GPIO27  (via drill 0.35)
  Top 0.305: JP6.2 80.5,51.9 v78,54.4 | v38,68.6 37.6,68.6 36.14,70.06 X1.13
  Route2 0.305: v78,54.4 73.4,59 39.2,59 38,60.2 v38,68.6
GPS_BOOTSEL
  Top 0.406: U6.9 39.32,24.79 38.66,24.13 38.66,20.08 GPS_BOOTSEL.1
GPS_RSTN
  Top 0.406: P8.32 33.02,15.24 33.02,17.8 33.76,18.54 35.23,18.54 36.47,19.79 36.47,22.63 34.54,24.56 34.54,27.2 38.53,31.19 U6.1
I2C2_SCL  (via drill 0.35)
  Route2 0.305: v24.97,30.53 24.97,21.16 JP4.4
  Route15 0.305: v24.97,30.53 25.09,30.53 31.52,36.96 35.61,36.96 45.8,47.14 45.8,63.58 P9.19
I2C2_SDA  (via drill 0.35)
  Route2 0.305: v26.59,30.53 26.59,22.07 JP4.5
  Route15 0.305: P9.20 47.04,62.18 47.04,46.81 38.76,38.53 38.73,38.53 36.85,36.65 36.85,32.87 34.49,30.5 26.62,30.5 v26.59,30.53
N$1  (via drill 2.5 pad 3.5)
  other vias: 13.72,33.68
N$2  (via drill 2.8 pad 6)
  other vias: 16.03,51
N$3  (via drill 2.5 pad 3.5)
  other vias: 34.04,20.98
N$4  (via drill 2.5 pad 3.5)
  other vias: 34.04,33.68
N$5  (via drill 3.17 pad 5.08)
  other vias: 74.96,15.29
N$6  (via drill 3.17 pad 5.08)
  other vias: 74.96,63.55
N$7  (via drill 3.17 pad 5.08)
  other vias: 8.92,18.34
N$8  (via drill 3.17 pad 5.08)
  other vias: 8.92,60.37
N$9  (via drill 2.8 pad 6)
  other vias: 16.03,74
N$10  (via drill 2.8 pad 6)
  other vias: 74.03,51
N$11  (via drill 2.8 pad 6)
  other vias: 74.03,74
N$14  (via drill 2.5 pad 3.5)
  other vias: 13.72,20.98
N$15
  Bottom 0.61: R1.2 57.36,54.25 U1.1
N$17
  Top 0.406: U6.32 49.98,30.39 50.85,29.52 50.85,13.26 49.3,11.71 11.35,11.71 10.33,12.74 J9.3
N$19
  Top 0.61: U5.9 74.34,18.62 77.92,18.62 J16.3
N$21
  Top 0.406: U6.7 38,26.39 D1.A
N$94
  Top 1.27: H1.P$4 8.91,85.99 R66.1
RADIO_RESET  (via drill 0.35)
  Top 0.406: v51.92,25.76 53.54,27.38 U5.6
  Route15 0.305: P8.36 27.91,15.21 27.91,16.99 28.78,17.86 48.01,17.86 48.03,17.83 51.42,21.22 51.42,25.26 v51.92,25.76
RPI_5V_PWR_IN  (via drill 0.35)
  Top 0.61: v14.6,77.8 20.45,77.8 X1.2
  Route15 0.61: v14.6,77.8 12,75.2 12,61.63 14.58,59.05 v28.52,59.05
  Bottom 0.61: v28.52,59.05 30.25,57.33 U2.8 U2.1 39.39,56.72 C2.1
RPI_ENABLE
  Bottom 0.406: P8.7 62.23,20.88 43.31,39.8 37.06,39.8 31.36,45.5 31.36,49.12 U2.4
RX+  (via drill 0.35)
  Top 0.305: v77.24,40.1 77.36,40.23 J2.2
  Bottom 0.305: J1.3 77.25,40.09 v77.24,40.1
RX-  (via drill 0.35)
  Top 0.305: J2.1 77.25,39.23 v77.17,39.15
  Bottom 0.305: J1.4 77.23,39.09 v77.17,39.15
SCL1_I2C  (via drill 0.35)
  Top 0.305: JP5.2 12.95,41.1 v13.69,41.84 | v25.4,68.6 25.98,69.18 X1.5
  Route2 0.305: v13.69,41.84 13.69,41.87 25.4,53.59 v25.4,68.6
SDA1_I2C  (via drill 0.35)
  Top 0.305: JP5.1 10.63,42.28 v12.12,43.77 12.12,66.32 15.2,69.4 22.2,69.4 X1.3
SPI0_CE0_N
  Top 0.305: JP7.3 83.5,66.9 85.4,68.8 85.4,77.05 83.67,78.78 49.58,78.78 48.84,78.04 X1.24
SPI0_CE1_N
  Top 0.305: JP7.5 80.38,68.9 77.8,71.48 77.8,75.2 75.4,77.6 72.5,77.6 70.6,75.7 70.6,74.91 69.86,74.17 53.52,74.17 52.44,75.25 52.44,76.29 X1.26
SPI0_MISO  (via drill 0.35)
  Top 0.305: JP7.2 79.7,65.9 v78.8,66.8 | X1.21 46.3,68.5 v46.2,68.4
  Route2 0.305: v78.8,66.8 77.2,68.4 v46.2,68.4
SPI0_MOSI  (via drill 0.35)
  Top 0.305: JP7.1 78.5,64.9 v76.6,66.8 | X1.19 43.8,70.6 v43.8,68.6
  Route2 0.305: v76.6,66.8 45.6,66.8 v43.8,68.6
SPI0_SCLK
  Top 0.305: JP7.4 50.77,67.9 49.08,69.59 49.08,70.64 X1.23
SPI1_CS1
  Top 0.406: U5.5 52.97,29.38 22.26,60.1 20.95,60.1 19.05,62 P9.42
SPI1_D0  (via drill 0.35)
  Top 0.406: U5.2 52.73,35.38 41.96,46.15 v41.96,46.18
  Route2 0.406: P9.29 35.51,63.55 35.51,61.19 41.96,54.74 v41.96,46.18
SPI1_D1
  Top 0.406: P9.30 34.29,52.22 53.13,33.38 U5.3
SPI1_SCLK
  Top 0.406: P9.31 31.75,64.59 30.33,63.17 30.33,54.15 53.1,31.38 U5.4
SW_5V_1
  Bottom 0.406: H1.2.13 29.84,88.27 31.11,87 79.35,87 80.92,85.42 80.92,78.32 J13.1
TX+  (via drill 0.35)
  Top 0.305: v77.24,42.1 77.36,42.23 J2.4
  Bottom 0.305: J1.1 77.25,42.09 v77.24,42.1
TX-  (via drill 0.35)
  Top 0.305: J2.3 77.27,41.23 v77.17,41.12
  Bottom 0.305: v77.17,41.12 77.21,41.09 J1.2
UART1_RXD
  Bottom 0.305: P9.26 38,63.6 38,65.8 36.6,67.2 14.14,67.2 9.33,72.01 9.33,76.4 J6.1
UART1_TXD
  Bottom 0.305: P9.24 40.63,63.51 40.63,65.41 38.24,67.8 14.48,67.8 9.98,72.3 9.98,75.05 12.22,77.29 12.22,78.45 11.58,79.1 J6.2
UART2_RXD  (via drill 0.35)
  Top 0.305: v31.71,79.53 30.7,79.53 X1.8
  Route2 0.305: P9.22 43.28,63.4 41.6,63.4 40.8,64.2 40.8,67.8 37.4,71.2 37.4,76 33.87,79.53 v31.71,79.53
UART2_TXD  (via drill 0.35)
  Top 0.305: v36.8,79.4 33.11,79.4 X1.10
  Route2 0.305: P9.21 44.45,65.37 42.61,67.21 42.61,76.19 39.4,79.4 v36.8,79.4
UART5_RXD
  Top 0.406: U6.44 40.06,32.69 38.86,32.69 28.98,22.81 28.98,18.49 27.89,17.4 27.89,15.95 27.13,15.19 25.35,15.19 P8.38
UART5_TXD
  Top 0.406: U6.42 42.32,32.53 41.48,33.38 38.15,33.38 26.39,21.61 26.39,18.57 24.33,16.51 P8.37

### Text on the board
tPlace: Raspberry Pi Zero | + | -
tNames: RPi_SPI | RPi_GPIO | RADIO | RPi_I2C | Ethernet | IMU | GPS | GPS_LED | OBC Board Rev. 1.0 / SN: ______________ | RADIO | GPS
bNames: BBB_PWR_IN | UART1 | RPi_EN | Temp | BB_Temp | Ethernet | GPIO | GPIO | GPIO